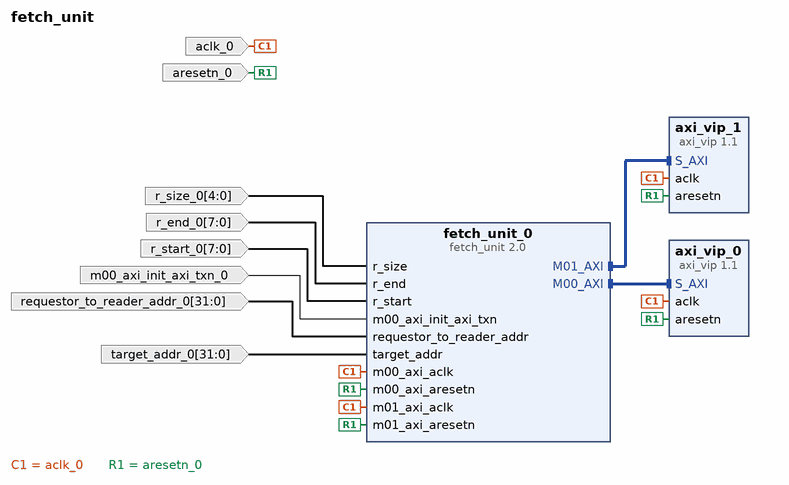
[diagram p0: block diagram of the top level]
# Vivado block design fetch_unit, xczu9eg-ffvb1156-2-e, Vivado 2017.4
create_bd_design fetch_unit

create_bd_port -dir I -type clk aclk_0
create_bd_port -dir I -type rst aresetn_0
create_bd_port -dir I -from 4 -to 0 r_size_0
create_bd_port -dir I -from 7 -to 0 r_end_0
create_bd_port -dir I -from 7 -to 0 r_start_0
create_bd_port -dir I m00_axi_init_axi_txn_0
create_bd_port -dir I -from 31 -to 0 requestor_to_reader_addr_0
create_bd_port -dir I -from 31 -to 0 target_addr_0

create_bd_cell -type ip -vlnv xilinx.com:ip:axi_vip:1.1 axi_vip_0
set_property -dict {CONFIG.INTERFACE_MODE SLAVE} [get_bd_cells axi_vip_0]
create_bd_cell -type ip -vlnv xilinx.com:ip:axi_vip:1.1 axi_vip_1
set_property -dict {CONFIG.INTERFACE_MODE SLAVE} [get_bd_cells axi_vip_1]
create_bd_cell -type ip -vlnv user.org:user:fetch_unit:2.0 fetch_unit_0
set_property -dict {CONFIG.C_M01_AXI_BURST_LEN 1 CONFIG.C_M00_AXI_BURST_LEN 1 CONFIG.BUS_BIT 8} [get_bd_cells fetch_unit_0]

# ---- connections ----

connect_bd_intf_net [get_bd_intf_pins axi_vip_0/S_AXI] [get_bd_intf_pins fetch_unit_0/M00_AXI]
connect_bd_intf_net [get_bd_intf_pins axi_vip_1/S_AXI] [get_bd_intf_pins fetch_unit_0/M01_AXI]
connect_bd_net -net aclk_0_1 [get_bd_ports aclk_0] \
  [get_bd_pins axi_vip_0/aclk] [get_bd_pins axi_vip_1/aclk] [get_bd_pins fetch_unit_0/m01_axi_aclk] \
  [get_bd_pins fetch_unit_0/m00_axi_aclk]
connect_bd_net -net aresetn_0_1 [get_bd_ports aresetn_0] \
  [get_bd_pins axi_vip_0/aresetn] [get_bd_pins axi_vip_1/aresetn] [get_bd_pins fetch_unit_0/m01_axi_aresetn] \
  [get_bd_pins fetch_unit_0/m00_axi_aresetn]
connect_bd_net -net r_size_0_1 [get_bd_ports r_size_0] [get_bd_pins fetch_unit_0/r_size]
connect_bd_net -net r_end_0_1 [get_bd_ports r_end_0] [get_bd_pins fetch_unit_0/r_end]
connect_bd_net -net r_start_0_1 [get_bd_ports r_start_0] [get_bd_pins fetch_unit_0/r_start]
connect_bd_net -net m00_axi_init_axi_txn_0_1 [get_bd_ports m00_axi_init_axi_txn_0] [get_bd_pins fetch_unit_0/m00_axi_init_axi_txn]
connect_bd_net -net requestor_to_reader_addr_0_1 [get_bd_ports requestor_to_reader_addr_0] [get_bd_pins fetch_unit_0/requestor_to_reader_addr]
connect_bd_net -net target_addr_0_1 [get_bd_ports target_addr_0] [get_bd_pins fetch_unit_0/target_addr]

# ---- address map ----
assign_bd_address -offset 0x44A00000 -range 64K -target_address_space [get_bd_addr_spaces fetch_unit_0/M00_AXI] [get_bd_addr_segs axi_vip_0/S_AXI/Reg]
assign_bd_address -offset 0x44A00000 -range 64K -target_address_space [get_bd_addr_spaces fetch_unit_0/M01_AXI] [get_bd_addr_segs axi_vip_1/S_AXI/Reg]

validate_bd_design
save_bd_design
